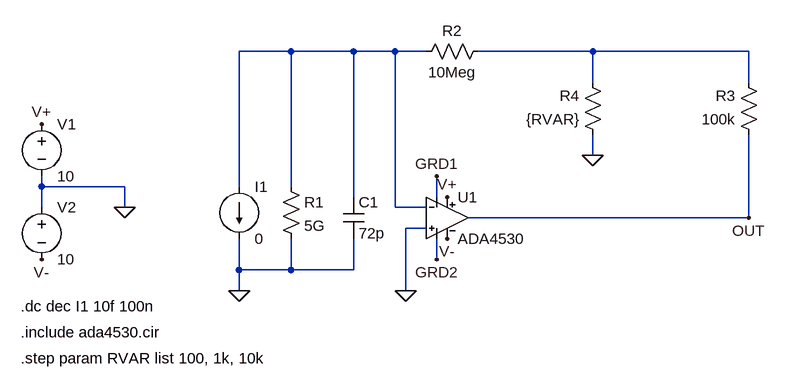
[diagram p0: schematic 003transimpedance_ada4530_three_res.asc]
003transimpedance_ada4530_three_res.asc, the LTspice schematic file:
Version 4
SHEET 1 1156 680
WIRE -2432 -320 -2512 -320
WIRE -2336 -320 -2432 -320
WIRE -2272 -320 -2336 -320
WIRE -2224 -320 -2272 -320
WIRE -1968 -320 -2144 -320
WIRE -1728 -320 -1968 -320
WIRE -1968 -272 -1968 -320
WIRE -1728 -272 -1728 -320
WIRE -1968 -160 -1968 -192
WIRE -2816 -112 -2816 -128
WIRE -2688 -112 -2816 -112
WIRE -2512 -112 -2512 -320
WIRE -2432 -112 -2432 -320
WIRE -2336 -96 -2336 -320
WIRE -2208 -96 -2208 -128
WIRE -2816 -80 -2816 -112
WIRE -2688 -80 -2688 -112
WIRE -2272 -80 -2272 -320
WIRE -2224 -80 -2272 -80
WIRE -1728 -64 -1728 -192
WIRE -1728 -64 -2160 -64
WIRE -2224 -48 -2256 -48
WIRE -2208 0 -2208 -32
WIRE -2512 16 -2512 -32
WIRE -2432 16 -2432 -32
WIRE -2432 16 -2512 16
WIRE -2336 16 -2336 -32
WIRE -2336 16 -2432 16
WIRE -2512 48 -2512 16
WIRE -2256 48 -2256 -48
FLAG -2512 48 0
FLAG -2256 48 0
FLAG -2688 -80 0
FLAG -2816 -208 V+
FLAG -2816 0 V-
FLAG -2192 -32 V-
FLAG -1728 -64 OUT
FLAG -1968 -160 0
FLAG -2208 -128 GRD1
FLAG -2192 -96 V+
FLAG -2208 0 GRD2
SYMBOL current -2512 -112 R0
WINDOW 123 0 0 Left 2
WINDOW 39 0 0 Left 2
SYMATTR InstName I1
SYMATTR Value 0
SYMBOL res -2448 -128 R0
SYMATTR InstName R1
SYMATTR Value 5G
SYMBOL cap -2352 -96 R0
SYMATTR InstName C1
SYMATTR Value 72p
SYMBOL res -2128 -336 R90
WINDOW 0 0 56 VBottom 2
WINDOW 3 32 56 VTop 2
SYMATTR InstName R2
SYMATTR Value 10Meg
SYMBOL voltage -2816 -224 R0
WINDOW 123 0 0 Left 2
WINDOW 39 0 0 Left 2
SYMATTR InstName V1
SYMATTR Value 10
SYMBOL voltage -2816 -96 R0
WINDOW 123 0 0 Left 2
WINDOW 39 0 0 Left 2
SYMATTR InstName V2
SYMATTR Value 10
SYMBOL res -1712 -176 R180
WINDOW 0 36 76 Left 2
WINDOW 3 36 40 Left 2
SYMATTR InstName R3
SYMATTR Value 100k
SYMBOL res -1952 -176 R180
WINDOW 0 36 76 Left 2
WINDOW 3 36 40 Left 2
SYMATTR InstName R4
SYMATTR Value {RVAR}
SYMBOL opamp_with_guards -2192 -128 R0
SYMATTR InstName U1
SYMATTR Value ADA4530
TEXT -2848 72 Left 2 !.dc dec I1 10f 100n
TEXT -2848 112 Left 2 !.include ada4530.cir
TEXT -2848 152 Left 2 !.step param RVAR list 100, 1k, 10k

The netlist it stands for:
* 003transimpedance_ada4530_three_res.asc
I1 N001 0 0
R1 N001 0 5G
C1 N001 0 72p
R2 N002 N001 10Meg
V1 V+ 0 10
V2 0 V- 10
R3 OUT N002 100k
R4 0 N002 {RVAR}
XU1 0 N001 V+ V- OUT GRD1 GRD2 ADA4530  ; pins In+ In- V+ V- OUT GRD1 GRD2
.dc dec I1 10f 100n
.include ada4530.cir
.step param RVAR list 100, 1k, 10k
.backanno
.end